# Altium schematic sheet [3]Digital.SchDoc
size A2
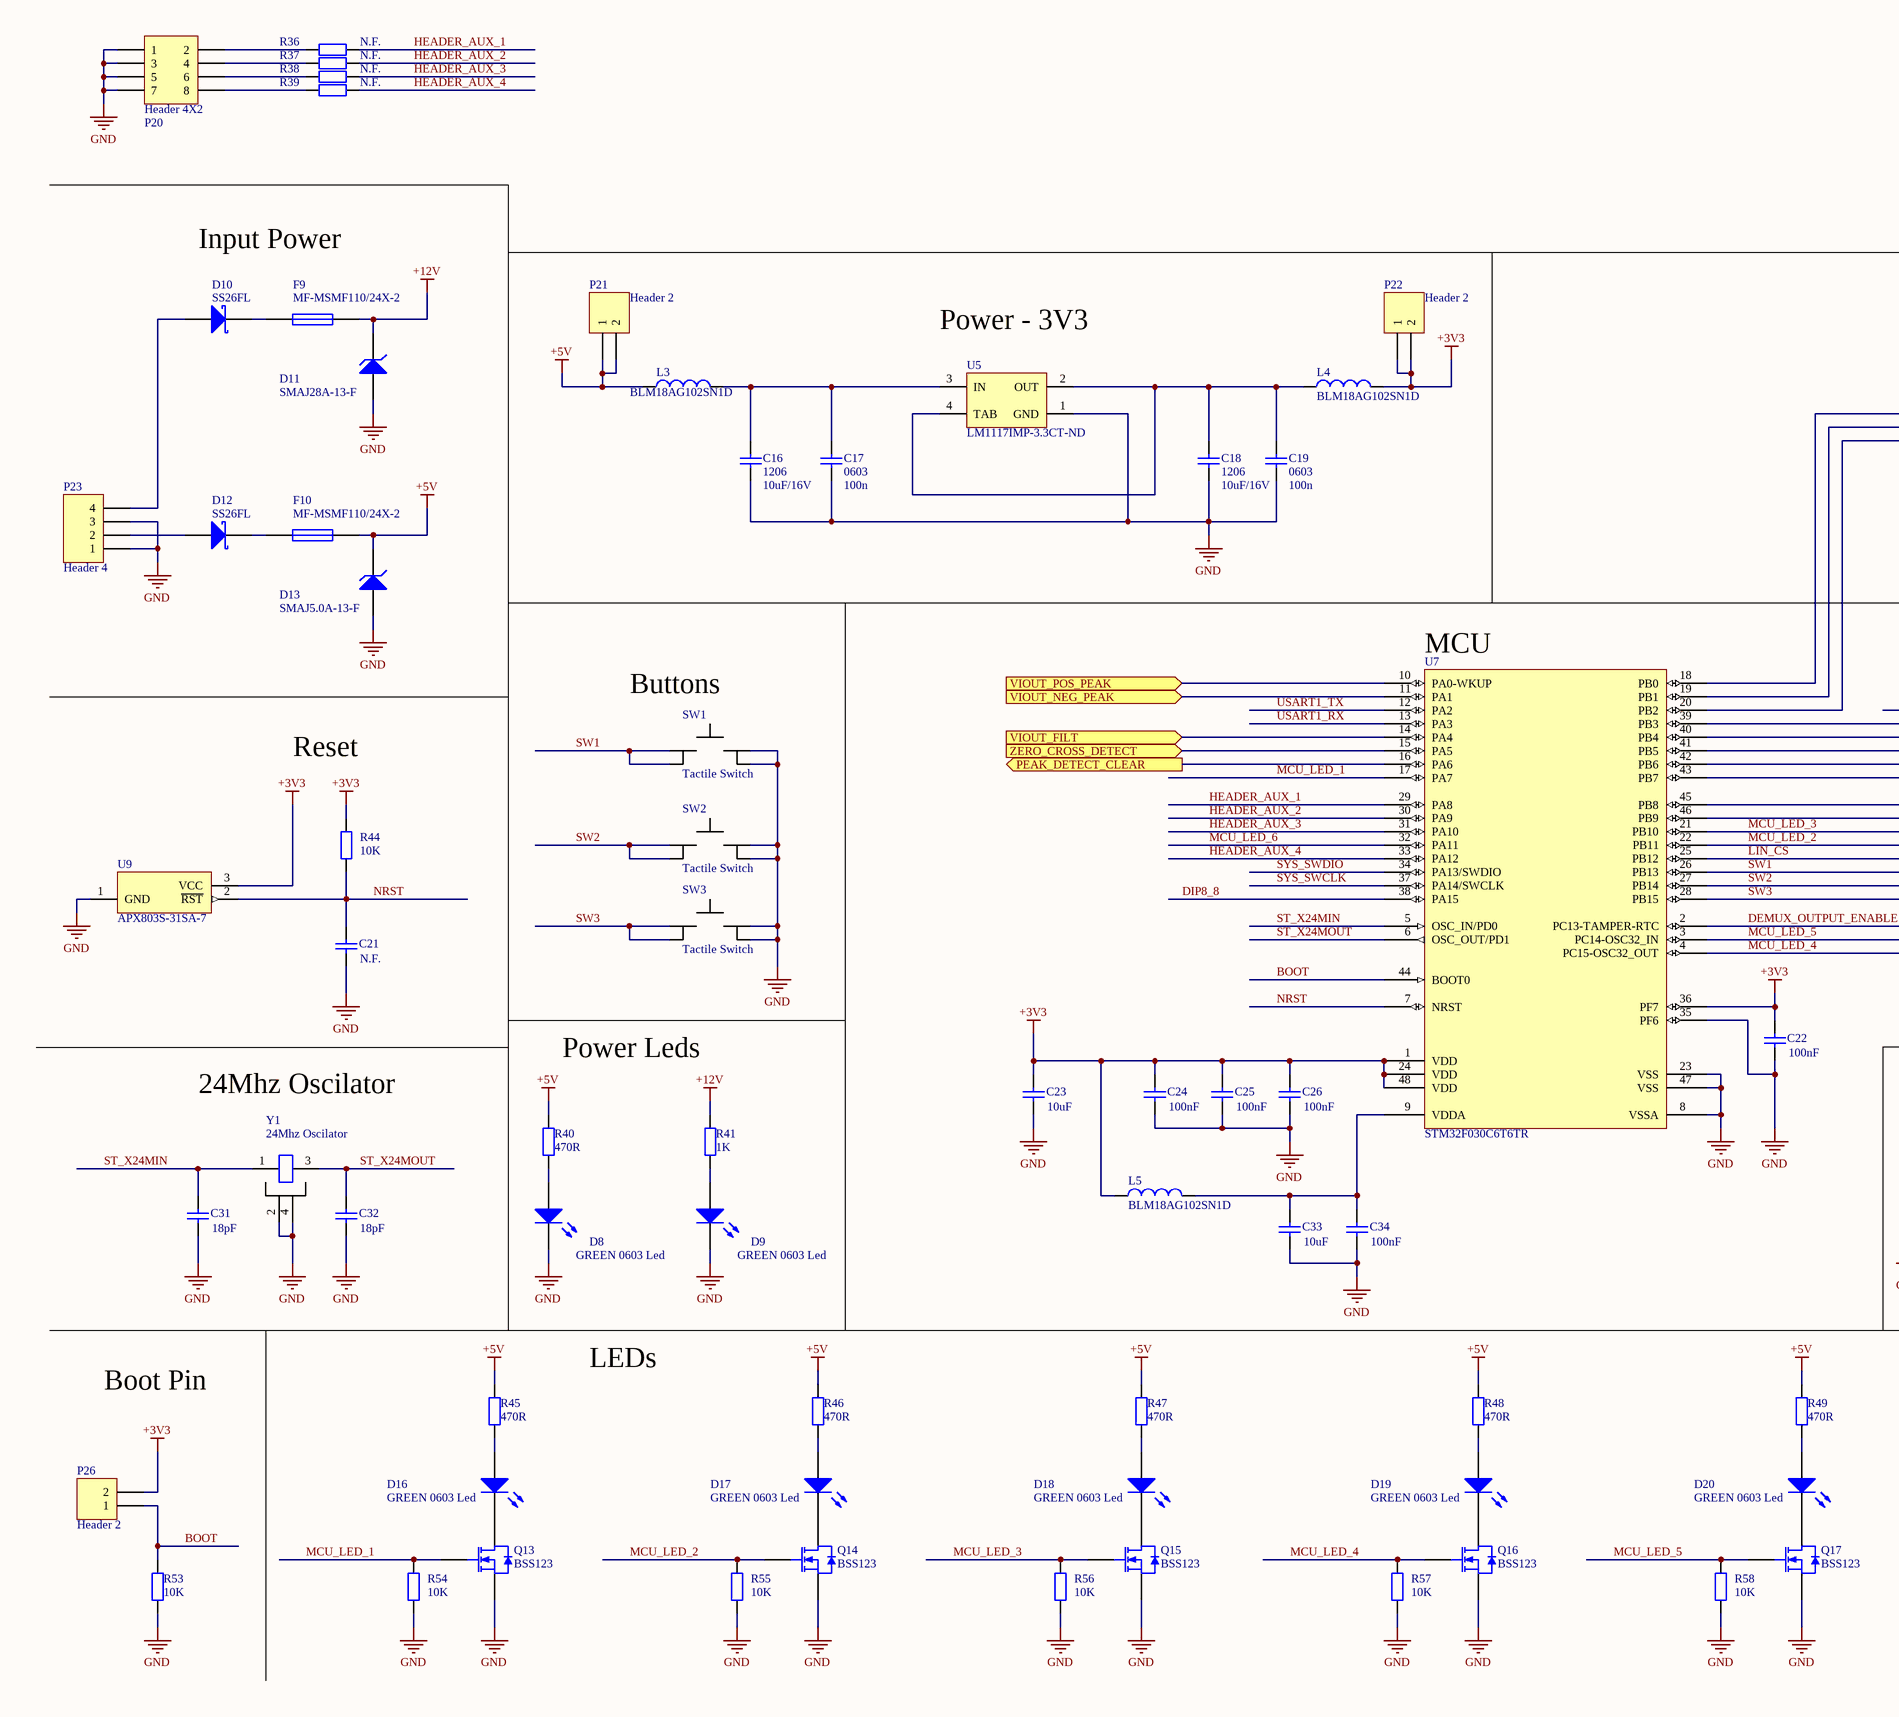
[diagram p0: [3]Digital.SchDoc, left]
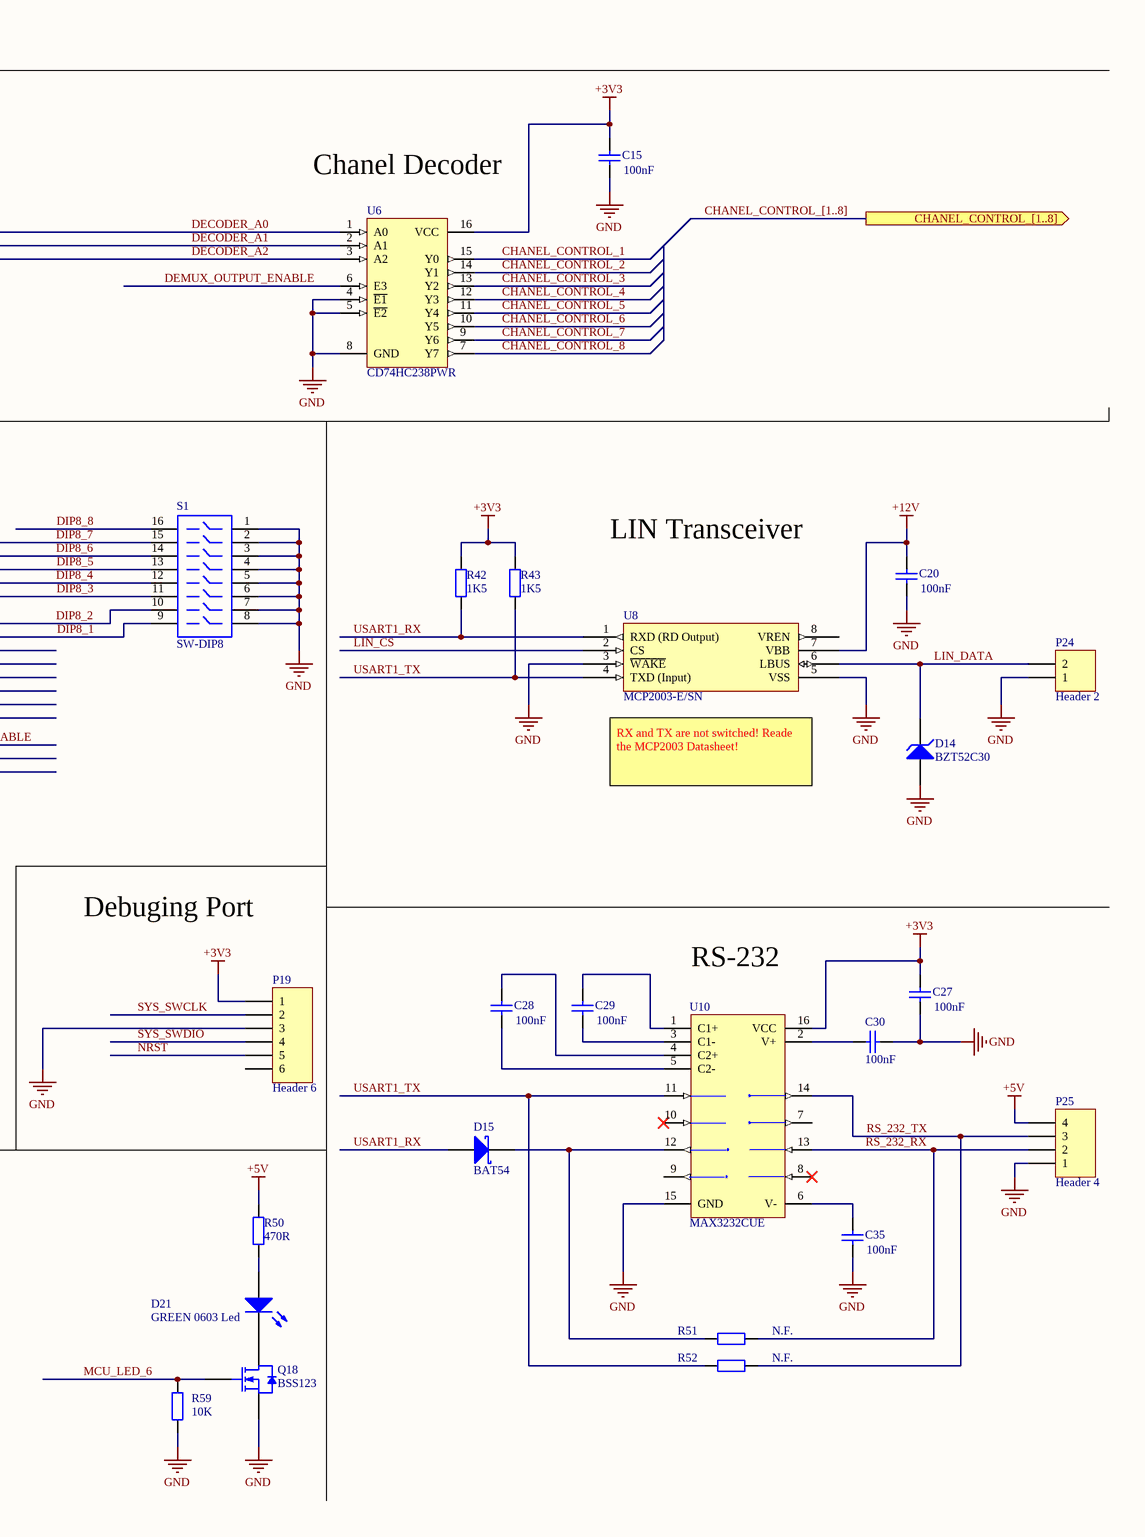
[diagram p1: [3]Digital.SchDoc, right]

## Parts
C15  value 100nF  [1608[0603]]  (hidden comment: 0603)
C16  1206  value 10uF/16V  [C1206]
C17  0603  value 100n  [1608[0603]]
C18  1206  value 10uF/16V  [C1206]
C19  0603  value 100n  [1608[0603]]
C20  value 100nF  [1608[0603]]  (hidden comment: 0603)
C21  value N.F.  [1608[0603]]  (hidden comment: 0603)
C22  value 100nF  [1608[0603]]  (hidden comment: 0603)
C23  value 10uF  [1608[0603]]  (hidden comment: 0603)
C24  value 100nF  [1608[0603]]  (hidden comment: 0603)
C25  value 100nF  [1608[0603]]  (hidden comment: 0603)
C26  value 100nF  [1608[0603]]  (hidden comment: 0603)
C27  value 100nF  [1608[0603]]  (hidden comment: 0603)
C28  value 100nF  [1608[0603]]  (hidden comment: 0603)
C29  value 100nF  [1608[0603]]  (hidden comment: 0603)
C30  value 100nF  [1608[0603]]  (hidden comment: 0603)
C31  value 18pF  [1608[0603]]  (hidden comment: 0603)
C32  value 18pF  [1608[0603]]  (hidden comment: 0603)
C33  value 10uF  [1608[0603]]  (hidden comment: 0603)
C34  value 100nF  [1608[0603]]  (hidden comment: 0603)
C35  value 100nF  [1608[0603]]  (hidden comment: 0603)
D8  GREEN 0603 Led  [LED0603]
D9  GREEN 0603 Led  [LED0603]
D10  SS26FL  [SOD123F]
D11  SMAJ28A-13-F  [SMA]
D12  SS26FL  [SOD123F]
D13  SMAJ5.0A-13-F  [SMA]
D14  BZT52C30  [SOD123]
D15  BAT54  [SOT-23_N]
D16  GREEN 0603 Led  [LED0603]
D17  GREEN 0603 Led  [LED0603]
D18  GREEN 0603 Led  [LED0603]
D19  GREEN 0603 Led  [LED0603]
D20  GREEN 0603 Led  [LED0603]
D21  GREEN 0603 Led  [LED0603]
F9  MF-MSMF110/24X-2  [CAPC4532L]
F10  MF-MSMF110/24X-2  [CAPC4532L]
L3  BLM18AG102SN1D  [1608[0603]]
L4  BLM18AG102SN1D  [1608[0603]]
L5  BLM18AG102SN1D  [1608[0603]]
P19  Header 6  [HDR1X6]
P20  Header 4X2  [HDR2X4]
P21  Header 2  [HDR1X2]
P22  Header 2  [HDR1X2]
P23  Header 4  [284391-4]
P24  Header 2  [284391-2]
P25  Header 4  [284391-4]
P26  Header 2  [HDR1X2]
Q13  BSS123  [SOT23_N]
Q14  BSS123  [SOT23_N]
Q15  BSS123  [SOT23_N]
Q16  BSS123  [SOT23_N]
Q17  BSS123  [SOT23_N]
Q18  BSS123  [SOT23_N]
R36  value N.F.  [J1-0603]  (hidden comment: 0603)
R37  value N.F.  [J1-0603]  (hidden comment: 0603)
R38  value N.F.  [J1-0603]  (hidden comment: 0603)
R39  value N.F.  [J1-0603]  (hidden comment: 0603)
R40  value 470R  [J1-0603]  (hidden comment: 0603)
R41  value 1K  [J1-0603]  (hidden comment: 0603)
R42  value 1K5  [J1-0603]  (hidden comment: 0603)
R43  value 1K5  [J1-0603]  (hidden comment: 0603)
R44  value 10K  [J1-0603]  (hidden comment: 0603)
R45  value 470R  [J1-0603]  (hidden comment: 0603)
R46  value 470R  [J1-0603]  (hidden comment: 0603)
R47  value 470R  [J1-0603]  (hidden comment: 0603)
R48  value 470R  [J1-0603]  (hidden comment: 0603)
R49  value 470R  [J1-0603]  (hidden comment: 0603)
R50  value 470R  [J1-0603]  (hidden comment: 0603)
R51  value N.F.  [J1-0603]  (hidden comment: 0603)
R52  value N.F.  [J1-0603]  (hidden comment: 0603)
R53  value 10K  [J1-0603]  (hidden comment: 0603)
R54  value 10K  [J1-0603]  (hidden comment: 0603)
R55  value 10K  [J1-0603]  (hidden comment: 0603)
R56  value 10K  [J1-0603]  (hidden comment: 0603)
R57  value 10K  [J1-0603]  (hidden comment: 0603)
R58  value 10K  [J1-0603]  (hidden comment: 0603)
R59  value 10K  [J1-0603]  (hidden comment: 0603)
S1  SW-DIP8  [DIP-16-KEY]
SW1  Tactile Switch  [FSM14JLH]
SW2  Tactile Switch  [FSM14JLH]
SW3  Tactile Switch  [FSM14JLH]
U5  LM1117IMP-3.3CT-ND  [MP04A_N]
U6  CD74HC238PWR  [TSOP65P640-16AL]
U7  STM32F030C6T6TR  [LQFP48_N]
U8  MCP2003-E/SN  [SOIC127P600-8AL]
U9  APX803S-31SA-7  [RT-3]
U10  MAX3232CUE  [TSSOP16_L]
Y1  24Mhz Oscilator  [SMD Crysta 2 x 1.6]

## Ports
CHANEL_CONTROL_[1..8] (out), PEAK_DETECT_CLEAR (out), VIOUT_FILT (in), VIOUT_NEG_PEAK (in), VIOUT_POS_PEAK (in), ZERO_CROSS_DETECT (in)

## Nets
+3V3: C15.2 C22.2 C23.2 C24.2 C25.2 C26.2 C27.2 L4.2 L5.1 P19.1 P22.1 P22.2 P26.2 R42.2 R43.2 R44.2 U6.16(VCC) U7.1(VDD) U7.24(VDD) U7.36(PF7) U7.48(VDD) U9.3(VCC) U10.16(VCC)
+5V: D13.2(K) F10.2 L3.1 P21.1 P21.2 P25.4 R40.2 R45.2 R46.2 R47.2 R48.2 R49.2 R50.2
+12V: C20.2 D11.2(K) F9.2 R41.2 U8.7(VBB)
GND: C15.1 C16.1 C17.1 C18.1 C19.1 C20.1 C21.1 C22.1 C23.1 C24.1 C25.1 C26.1 C27.1 C30.1 C31.2 C32.2 C33.1 C34.1 C35.1 D8.2(K) D9.2(K) D11.1(A) D13.1(A) D14.1(A) P19.3 P20.1 P20.3 P20.5 P20.7 P23.1 P23.3 P24.1 P25.1 Q13.2(S) Q14.2(S) Q15.2(S) Q16.2(S) Q17.2(S) Q18.2(S) R53.2 R54.1 R55.1 R56.1 R57.1 R58.1 R59.1 S1.1 S1.2 S1.3 S1.4 S1.5 S1.6 S1.7 S1.8 SW1.1 SW1.2 SW2.1 SW2.2 SW3.1 SW3.2 U5.1(GND) U6.4(~{E1}) U6.5(~{E2}) U6.8(GND) U7.8(VSSA) U7.23(VSS) U7.35(PF6) U7.47(VSS) U8.3(~{WAKE}) U8.5(VSS) U9.1(GND) U10.15(GND) Y1.2(GND) Y1.4
BOOT: P26.1 R53.1 U7.44(BOOT0)
CHANEL_CONTROL_1: U6.15(Y0)
CHANEL_CONTROL_2: U6.14(Y1)
CHANEL_CONTROL_3: U6.13(Y2)
CHANEL_CONTROL_4: U6.12(Y3)
CHANEL_CONTROL_5: U6.11(Y4)
CHANEL_CONTROL_6: U6.10(Y5)
CHANEL_CONTROL_7: U6.9(Y6)
CHANEL_CONTROL_8: U6.7(Y7)
DECODER_A0: U6.1(A0) U7.18(PB0)
DECODER_A1: U6.2(A1) U7.19(PB1)
DECODER_A2: U6.3(A2) U7.20(PB2)
DEMUX_OUTPUT_ENABLE: U6.6(E3) U7.2(PC13-TAMPER-RTC)
DIP8_1: S1.9 U7.46(PB9)
DIP8_2: S1.10 U7.45(PB8)
DIP8_3: S1.11 U7.43(PB7)
DIP8_4: S1.12 U7.42(PB6)
DIP8_5: S1.13 U7.41(PB5)
DIP8_6: S1.14 U7.40(PB4)
DIP8_7: S1.15 U7.39(PB3)
DIP8_8: S1.16 U7.38(PA15)
HEADER_AUX_1: R36.1 U7.29(PA8)
HEADER_AUX_2: R37.1 U7.30(PA9)
HEADER_AUX_3: R38.1 U7.31(PA10)
HEADER_AUX_4: R39.1 U7.33(PA12)
LIN_CS: U7.25(PB12) U8.2(CS)
LIN_DATA: D14.2(K) P24.2 U8.6(LBUS)
MCU_LED_1: Q13.1(G) R54.2 U7.17(PA7)
MCU_LED_2: Q14.1(G) R55.2 U7.22(PB11)
MCU_LED_3: Q15.1(G) R56.2 U7.21(PB10)
MCU_LED_4: Q16.1(G) R57.2 U7.4(PC15-OSC32_OUT)
MCU_LED_5: Q17.1(G) R58.2 U7.3(PC14-OSC32_IN)
MCU_LED_6: Q18.1(G) R59.2 U7.32(PA11)
NRST: C21.2 P19.5 R44.1 U7.7(NRST) U9.2(~{RST})
PEAK_DETECT_CLEAR: U7.16(PA6) ; port PEAK_DETECT_CLEAR
RS_232_RX: P25.2 R51.2 U10.13(R1IN)
RS_232_TX: P25.3 R52.2 U10.14(T1OUT)
ST_X24MIN: C31.1 U7.5(OSC_IN/PD0) Y1.1(OSC1)
ST_X24MOUT: C32.1 U7.6(OSC_OUT/PD1) Y1.3(OSC2)
SW1: SW1.3 SW1.4 U7.26(PB13)
SW2: SW2.3 SW2.4 U7.27(PB14)
SW3: SW3.3 SW3.4 U7.28(PB15)
SYS_SWCLK: P19.2 U7.37(PA14/SWCLK)
SYS_SWDIO: P19.4 U7.34(PA13/SWDIO)
USART1_RX: D15.1(A) R42.1 U7.13(PA3) U8.1(RXD_(RD_Output))
USART1_TX: R43.1 R52.1 U7.12(PA2) U8.4(TXD_(Input)) U10.11(T1IN)
VIOUT_FILT: U7.14(PA4) ; port VIOUT_FILT
VIOUT_NEG_PEAK: U7.11(PA1) ; port VIOUT_NEG_PEAK
VIOUT_POS_PEAK: U7.10(PA0-WKUP) ; port VIOUT_POS_PEAK
ZERO_CROSS_DETECT: U7.15(PA5) ; port ZERO_CROSS_DETECT
NetC16_2: C16.2 C17.2 L3.2 U5.3(IN)
NetC18_2: C18.2 C19.2 L4.1 U5.2(OUT) U5.4(TAB)
NetC28_1: C28.1 U10.5(C2-)
NetC28_2: C28.2 U10.4(C2+)
NetC29_1: C29.1 U10.3(C1-)
NetC29_2: C29.2 U10.1(C1+)
NetC30_2: C30.2 U10.2(V+)
NetC33_2: C33.2 C34.2 L5.2 U7.9(VDDA)
NetC35_2: C35.2 U10.6(V-)
NetD8_1: D8.1(A) R40.1
NetD9_1: D9.1(A) R41.1
NetD10_1: D10.1(A) P23.4
NetD10_2: D10.2(K) F9.1
NetD12_1: D12.1(A) P23.2
NetD12_2: D12.2(K) F10.1
NetD15_3: D15.3(K) R51.1 U10.12(R1OUT)
NetD16_1: D16.1(A) R45.1
NetD16_2: D16.2(K) Q13.3(D)
NetD17_1: D17.1(A) R46.1
NetD17_2: D17.2(K) Q14.3(D)
NetD18_1: D18.1(A) R47.1
NetD18_2: D18.2(K) Q15.3(D)
NetD19_1: D19.1(A) R48.1
NetD19_2: D19.2(K) Q16.3(D)
NetD20_1: D20.1(A) R49.1
NetD20_2: D20.2(K) Q17.3(D)
NetD21_1: D21.1(A) R50.1
NetD21_2: D21.2(K) Q18.3(D)
NetP20_2: P20.2 R36.2
NetP20_4: P20.4 R37.2
NetP20_6: P20.6 R38.2
NetP20_8: P20.8 R39.2

Not connected (* = marked no-connect by the designer): P19 6; U8 8(VREN); U10 7(T2OUT) 8(R2IN)* 9(R2OUT) 10(T2IN)*

## Buses and harness runs
bus CHANEL_CONTROL_[1..8] = port CHANEL_CONTROL_[1..8]

## Notes on the sheet
- Input Power
- (near U5) Power - 3V3
- (near U6) Chanel Decoder
- (near U7) MCU
- (near SW1) Buttons
- LIN Transceiver
- Reset
- (near U8) RX and TX are not switched! Reade the MCP2003 Datasheet!
- Power Leds
- 24Mhz Oscilator
- Debuging Port
- RS-232
- Boot Pin
- LEDs

## Library data of the parts
C15-C35 = Cap: Capacitor; Note: We have them in Bulgaria; Published: 8-Jun-2000; LatestRevisionDate: 17-Jul-2002; LatestRevisionNote: Re-released for DXP Platform.; PackageReference: RAD-0.3; Publisher: Altium Limited; PackageDescription: Radial Cap, Thru-Hole; 2 Leads; 0.3 in Pin Spacing
  C15 C17 C19 C20 C22 C24-C30 C34 C35: Distributor Link: http://uk.farnell.com/kemet/c0603x104k4ractu/cap-mlcc-x7r-100nf-16v-0603/dp/1414027; Case Code (in): 0603
  C16 C18: Distributor Link: http://uk.farnell.com/kemet/c1206c106k4ractu/cap-mlcc-x7r-10uf-16v-1206/dp/1463368; Case Code (in): 1206
  C21: Case Code (in): 0603
  C23 C33: Distributor Link: https://eu.mouser.com/ProductDetail/Taiyo-Yuden/JMK107ABJ106MA-T?qs=sGAEpiMZZMvsSlwiRhF8qtYrDJZp5VWM0KJHW32Kpw4hdLhJsFnoCA%3d%3d; Case Code (in): 0603
  C31 C32: Distributor Link: https://eu.mouser.com/ProductDetail/AVX/06035A180JAT4A?qs=sGAEpiMZZMvsSlwiRhF8qoLJPdUUh17q4jx5a%252bHkpSk%3d; Case Code (in): 0603
D8 D9 D16-D21 = LED0: Typical INFRARED GaAs LED; Manufacturer Name: KINGBRIGHT; Manufacturer Part No.: KPT-1608CGCK; Note: We have them in Bulgaria; Published: 8-Jun-2000; LatestRevisionDate: 08-Jul-2005; LatestRevisionNote: Mech Layer 1 removed.; PackageReference: LED-0; Publisher: Altium Limited; PackageDescription: LED; 2 Leads; Distributor Link: http://uk.farnell.com/kingbright/kpt-1608cgck/led-green-0603-smd/dp/2099220; Price (per 100 in GBP): 0.09
D10 D12 = Diode 11DQ03: Schottky Rectifier; Manufacturer Name: ON Semiconductor / Fairchild; Note: We have them in Bulgaria; Published: 8-Jun-2000; LatestRevisionDate: 17-Jul-2002; LatestRevisionNote: Re-released for DXP Platform.; DatasheetVersion: Dec-1997; PackageReference: DO-204AL; Publisher: Altium Limited; PackageDescription: Diode, Axial; Body 5.2 x 2.7 mm (LxDia. max), Lead Dia. 0.86 mm (max); Code_JEDEC: DO-204-AL; ComponentLink1Description: Manufacturer Link; ComponentLink1URL: http://www.irf.com/; ComponentLink2Description: Datasheet; ComponentLink2URL: http://www.irf.com/product-info/datasheets/data/11dq03.pdf; Manufacturer Part No.: SS26FL; Distributor Link: https://eu.mouser.com/ProductDetail/ON-Semiconductor-Fairchild/SS26FL?qs=%2fha2pyFadujLdiyCszVoPuNvgYhu%2f%252bxuyuTPMeW7IG4%3d
D11 D13 = D Zener: Zener Diode; Manufacturer Name: Diodes Incorporated; Note: We have them in Bulgaria; Published: 8-Jun-2000; LatestRevisionDate: 17-Jul-2002; LatestRevisionNote: Re-released for DXP Platform.; PackageReference: DIODE-0.7; Publisher: Altium Limited; Price (per 100 in GBP): 0.12
  D11: Distributor Link: https://eu.mouser.com/ProductDetail/Diodes-Incorporated/SMAJ28A-13-F?qs=gaDBXWSqsDBA900rgyLC7w==; Manufacturer Part No.: SMAJ28A-13-F
  D13: Distributor Link: https://www.digikey.bg/product-detail/en/diodes-incorporated/SMAJ5.0A-13-F/SMAJ5.0A-FDICT-ND/816522; Manufacturer Part No.: SMAJ5.0A-13-F
D14 = D Zener: Zener Diode; Manufacturer Name: Diodes Incorporated; Manufacturer Part No.: BZT52C30-7-F; Published: 8-Jun-2000; LatestRevisionDate: 17-Jul-2002; LatestRevisionNote: Re-released for DXP Platform.; PackageReference: DIODE-0.7; Publisher: Altium Limited; PackageDescription: Diode, Thru-Hole; 2 Leads; 0.7 in Pin Spacing; Distributor Link: https://eu.mouser.com/ProductDetail/Diodes-Incorporated/BZT52C30-7-F?qs=zLeapIUCO8RFisLH9UF7WA%3D%3D
D15 = Diode BAT17: Silicon RF Schottky Diode for Mixer Applications in the VHF/UHF Range; Manufacturer Name: ON SEMICONDUCTOR; Manufacturer Part No.: BAT54LT1G; Note: We have them in Bulgaria; Published: 21-Mar-2003; LatestRevisionDate: 29-May-2009; LatestRevisionNote: IPC-7351 Footprint Added.; DatasheetVersion: Oct-1999; PackageVersion: Sep-2001; PackageReference: SOT-23; Publisher: Altium Limited; PackageDescription: 3-Pin SOT-23 Package 0.95 mm Pitch, 2.5 mm Lead Span; ComponentLink1Description: Manufacturer Link; ComponentLink1URL: http://www.infineon.com/; ComponentLink2Description: Datasheet; ComponentLink2URL: http://www.infineon.com/upload/Document/cmc_upload/documents/009/363/bat17series.pdf; Distributor Link: https://uk.farnell.com/on-semiconductor/bat54lt1g/diode-signal-30v-sot-23/dp/1431113
F9 F10 = Fuse 1: Fuse; Manufacturer Name: Bourns; Manufacturer Part No.: MF-MSMF050-2; Note: We have them in Bulgaria; Published: 8-Jun-2000; LatestRevisionDate: 17-Jul-2002; LatestRevisionNote: Re-released for DXP Platform.; PackageReference: PIN-W2/E2.8; Publisher: Altium Limited; Price (per 100 in GBP): 0.08
L3-L5 = Inductor: Manufacturer Name: Murata; Note: We have them in Bulgaria; Manufacturer Part No.: BLM18AG102SN1D; Distributor Link: https://eu.mouser.com/ProductDetail/Murata-Electronics/BLM18AG102SN1D?qs=%2fha2pyFadui%252bmEFJIul6r5GpWOyARRlB97lxmShlzChqi9G%252bTjWC9w%3d%3d
P19 = Header 6: Header, 6-Pin; LatestRevisionDate: 17-Jul-2002; LatestRevisionNote: Re-released for DXP Platform.; Publisher: Altium Limited
P20 = Header 4X2: Header, 4-Pin, Dual row; LatestRevisionDate: 17-Jul-2002; LatestRevisionNote: Re-released for DXP Platform.; Publisher: Altium Limited
P21 P22 P24 P26 = Header 2: Header, 2-Pin; LatestRevisionDate: 17-Jul-2002; LatestRevisionNote: Re-released for DXP Platform.; Publisher: Altium Limited
P23 P25 = Header 4: Header, 4-Pin; LatestRevisionDate: 17-Jul-2002; LatestRevisionNote: Re-released for DXP Platform.; Publisher: Altium Limited
Q13-Q18 = BSS123: N-channel Enhancement Mode Vertical D-MOSFET; Manufacturer Name: ON Semiconductor; Note: We have them in Bulgaria; Published: 17-Sep-2003; LatestRevisionDate: 12-Dec-2006; LatestRevisionNote: IPC-7351 Footprint Added.; DatasheetVersion: Apr-1995; PackageVersion: May-1999; PackageReference: SOT23; Publisher: Altium Limited; PackageDescription: 3-Pin SOT-23 Package 0.95 mm Pitch, 2.3 mm Lead Span; ComponentLink1Description: Manufacturer Link; ComponentLink1URL: http://www.semiconductors.philips.com/; ComponentLink2Description: Datasheet; ComponentLink2URL: http://www.semiconductors.philips.com/acrobat/datasheets/BSS123_3.pdf; Distributor Link: https://eu.mouser.com/ProductDetail/ON-Semiconductor/BSS123LT1G?qs=sGAEpiMZZMshyDBzk1%2fWizSW%252bwlCH%2fhMYWCTWBfWgg8%3d; Manufacturer Part No.: BSS123
R36-R59 = Res2: Resistor; Note: We have them in Bulgaria; Published: 8-Jun-2000; LatestRevisionDate: 17-Jul-2002; LatestRevisionNote: Re-released for DXP Platform.; PackageReference: AXIAL-0.4; Publisher: Altium Limited; PackageDescription: Axial Device, Thru-Hole; 2 Leads; 0.4 in Pin Spacing; Case Code (in): 0603
  R40 R45-R50: Distributor Link: https://uk.farnell.com/vishay/crcw0603470rfkea/res-470r-1-0-1w-0603-thick-film/dp/1469815RL
  R41: Distributor Link: https://uk.farnell.com/vishay/mct06030c1001fp500/res-1k-1-0-1w-0603-thin-film/dp/2325213
  R42 R43: Distributor Link: https://uk.farnell.com/panasonic/erj3ekf1501v/res-1k5-1-0-1w-0603-thick-film/dp/2303156
  R44 R53-R59: Distributor Link: http://uk.farnell.com/multicomp/mcwr06x1002ftl/res-thick-film-10k-1-0-1w-0603/dp/2447230
S1 = SW-DIP8: 4009 Series DIP Switch, Raised actuator; Manufacturer Name: CTS Electronic Components; Manufacturer Part No.: 210-8MS; Published: 24-Mar-1999; LatestRevisionDate: 17-Dec-2003; LatestRevisionNote: PCB Footprint replaced.; PackageReference: DIP-16-KEY; Publisher: Altium Limited; PackageDescription: DIP; 16 Leads; Row Spacing 7.62 mm; Pitch 2.54 mm; ComponentLink1Description: Manufacturer Link; ComponentLink1URL: http://www.oupiin.com/prodindx.html#Headers; Distributor Link: https://eu.mouser.com/ProductDetail/CTS-Electronic-Components/210-8MS?qs=sGAEpiMZZMv%2F%252B2JhlA6ysCW5ZokGCVhUojtEeWEz7Rc%3D
SW1-SW3 = Tactile Switch: Manufacturer Name: TE Connectivity; Manufacturer Part No.: FSM4JH; Distributor Link: https://eu.mouser.com/ProductDetail/TE-Connectivity-Alcoswitch/FSM4JH?qs=sGAEpiMZZMsgGjVA3toVBAK0o4DxfcqijSchET4px6U%3D; Price (per 100 in GBP): 0.12
U5 = LM1117IMP-3.3: 800mA Low-Dropout Linear Regulator; Manufacturer: National Semiconductor; Manufacturer Name: TI; CompType: LDO IC; PackageTopMarking: XYTT*N05B; PowerWise: N; Published: 4-Dec-2008; DatasheetVersion: Apr-2006; PackageVersion: revB, Apr-2003; PackageReference: MP04A; Publisher: Altium Limited; PackageDescription: Molded SOT-223, 6.50 x 3.56 x 1.6mm Body, 4 Lead, 2.3mm Pitch; PartNumber: LM1117IMP-3.3; RoHS: O; PinCount: 4; DigiKeyPartNumber: LM1117IMP-3.3CT-ND; Code_JEDEC: TO-261-AA; Code_IPC: SOT223-4; ComponentLink1Description: LM1117 Datasheet; ComponentLink1URL: http://www.national.com/ds/LM/LM1117.pdf; ComponentLink2Description: LM1117 Web Page; ComponentLink2URL: http://www.national.com/pf/LM/LM1117.html; ComponentLink3Description: MP04A Package Page; ComponentLink3URL: http://www.national.com/packaging/folders/mp04a.html; Manufacturer Part No.: LM1117IMP-3.3CT-ND; Distributor Link: http://uk.farnell.com/texas-instruments/lm1117imp-3-3-nopb/ldo-1-2vdo-3-3v-1-0-8a-3sot223/dp/1469051
U6 = CD74HC238PWR: High-Speed CMOS Logic 3- to 8-Line Decoder/Demultiplexer Inverting; Manufacturer Name: Texas Instruments; Distributor Link: https://www.mouser.co.uk/ProductDetail/Texas-Instruments/CD74HC238PWR?qs=sGAEpiMZZMtxONTBFIcRfgMIbQHDmxeviPxqNdAY%252BDU%3D; Manufacturer Part No.: CD74HC238PWR
U7 = STM32F030x4/6/8: STM32 ARM-based 32-bit MCU with 32 Kbytes Flash, 48-pin LQFP, Industrial Temperature; Manufacturer Name: STMicroelectronics; Note: Get 3 more.; Published: 30-May-2008; DatasheetVersion: rev6, Mar-2008; PackageVersion: Mar-2008; PackageReference: LQFP48; Publisher: Altium Limited; PackageDescription: 48-Pin Low-Profile Quad Flat Pack, 7 x 7 mm Body, 0.5 mm Pitch (LQFP48); ComponentLink1Description: Manufacturer Link; ComponentLink1URL: www.st.com/stm32; ComponentLink2Description: Datasheet; ComponentLink2URL: http://www.st.com/stonline/products/literature/ds/13586.pdf; Distributor Link: https://eu.mouser.com/ProductDetail/STMicroelectronics/STM32F030C6T6TR?qs=4b8myOmUP%252Bv8Ez53btAbrA%3D%3D; Manufacturer Part No.: STM32F030C6T6TR
U8 = MCP2003: LIN J2602 Transceiver; Manufacturer Name: Microchip Technology; Distributor Link: https://eu.mouser.com/ProductDetail/Microchip-Technology/MCP2003-E-SN?qs=ktxxVfK6xptrXDCRqAtS%252Bg%3D%3D; Manufacturer Part No.: MCP2003-E/SN
U9 = ADM809TART: Microprocessor Supervisory Circuit in 3-Pin SOT-23; Manufacturer Name: Diodes Incorporated; G2K_PN: G-IC-APX803-31SA-SOT-23-01; Note: We have them in Bulgaria; Published: 8-Jun-2000; LatestRevisionDate: 17-Jul-2002; LatestRevisionNote: Re-released for DXP Platform.; DatasheetVersion: REV.0 1997; PackageVersion: rev0; PackageReference: RT-3; Publisher: Altium Limited; PackageDescription: SOT-23; 3 Leads; Body 3.0 x 2.6 mm, inc. leads (LxW max); ComponentLink1Description: Manufacturer Link; ComponentLink1URL: http://www.analog.com/en/prod/0,,766_822_ADM809%2C00.html; ComponentLink2Description: Datasheet; ComponentLink2URL: http://www.analog.com/UploadedFiles/Data_Sheets/101131995ADM803_9_10_e.pdf; Price: .0; Price break at: 1000; Distributor Link: https://eu.mouser.com/ProductDetail/Diodes-Incorporated/APX803S-31SA-7?qs=%2Fha2pyFaduhebEAPwwFyerWu7K%252BS8dKoSHRSm1tt3Sf7eJGT%2FIrr6g%3D%3D; Manufacturer Part No.: APX803S-31SA-7; Price (per 100 in GBP): 0.11
U10 = MAX3232CUE: 3.0V TO 5.5V, Low-Power, up to 1Mbps, True RS-232 Transceiver Using Four 0.1µF External Capacitor; Manufacturer Part No.: MAX3232EIPWRQ1; Manufacturer Name: TI; Published: 16-Jan-2001; LatestRevisionDate: 29-May-2009; LatestRevisionNote: IPC-7351 Footprint Added.; DatasheetVersion: Mar-1999; PackageVersion: 21-0066 C; PackageReference: TSSOP16; Publisher: Altium Limited; PackageDescription: 16-Pin Thin Small Outline Package 0.65 mm Pitch; ComponentLink1Description: Manufacturer Link; ComponentLink1URL: http://www.maxim-ic.com/; ComponentLink2Description: Datasheet; ComponentLink2URL: http://pdfserv.maxim-ic.com/en/ds/MAX3222-MAX3241.pdf; Distributor Link: http://uk.farnell.com/texas-instruments/max3232eipwrq1/line-driv-rcvr-rs232-250kbps-ssop/dp/2335570
Y1 = XTAL: Manufacturer Name: AVX; Manufacturer Part No.: XRCGB24M000F2P00R0; Distributor Link: https://uk.farnell.com/murata/xrcgb24m000f2p00r0/crystal-24mhz-6pf-2-x-1-6mm/dp/2455832RL; Price (per 100 in GBP): 0.21